# Altium schematic sheet AC-Cable.SchDoc: AC-Cable
size A4; Date: JUN 2020; ApprovedBy: Hören; CheckedBy: Mörz; Author: Rudziński; CompanyName: Semi-ATE; DrawnBy: Rudziński; Engineer: Hören; Organization: Semi-ATE; DocumentNumber: 12; Revision: V1.0; SheetNumber: 12; SheetTotal: 20
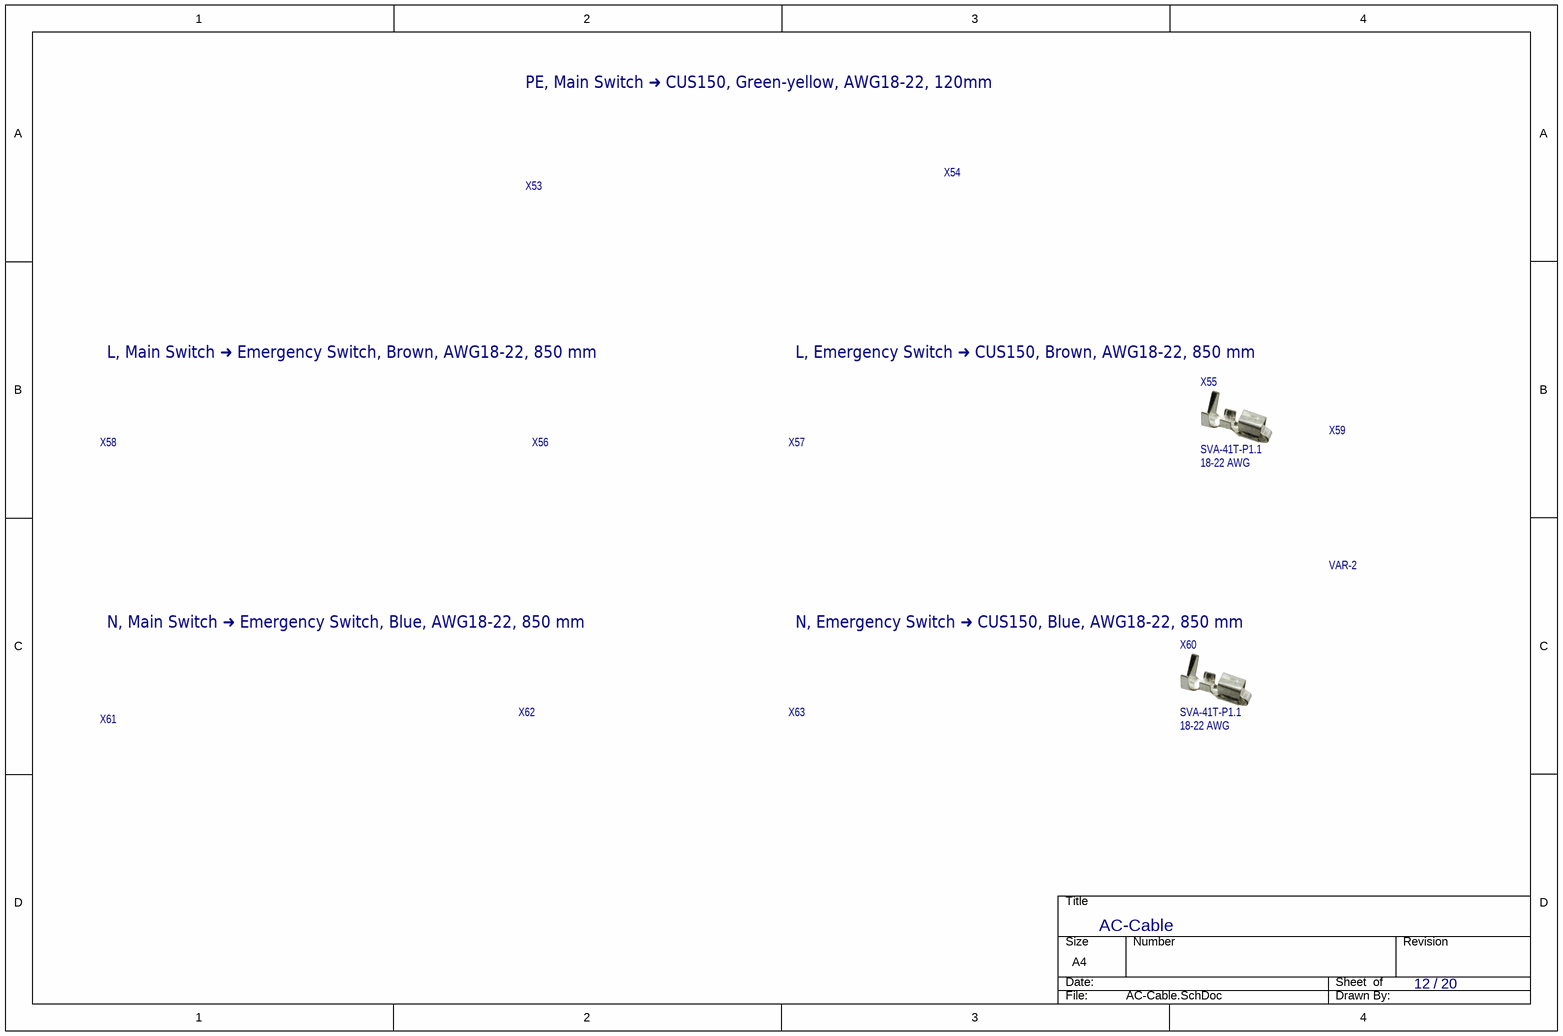
[diagram p0: AC-Cable.SchDoc]

## Parts
X53  X  (value not drawn)
X54  X  (value not drawn)
X55  Package: 18-22 AWG  (hidden comment: X)
X56  X  (value not drawn)
X57  X  (value not drawn)
X58  X  (value not drawn)
X59  X  (value not drawn)
X60  Package: 18-22 AWG  (hidden comment: X)
X61  X  (value not drawn)
X62  X  (value not drawn)
X63  X  (value not drawn)

## Notes on the sheet
- PE, Main Switch ➜ CUS150, Green-yellow, AWG18-22, 120mm
- L, Main Switch ➜ Emergency Switch, Brown, AWG18-22, 850 mm
- L, Emergency Switch ➜ CUS150, Brown, AWG18-22, 850 mm
- N, Main Switch ➜ Emergency Switch, Blue, AWG18-22, 850 mm
- N, Emergency Switch ➜ CUS150, Blue, AWG18-22, 850 mm
- /
- designed by
- reviewed by
- last drawn by
- Project:
- Schematic:
- last printed
- DIN-A4 L
- sheets
- of
- File:

## Library data of the parts
X53 X54 X56-X58 X61-X63 = 2-520407-2: CONN QC RCPT 18-22AWG 0.250; 04. Manufacturer: TE Connectivity AMP Connectors; 03. Unit Price: 0.36; 13. Created Date/Name: AUG 2018 / Hören; System: Connector; 01. Distributor: DigiKey; 02. Distributor Part Number: A27854-ND; 07. Manufacturer  Part Number: 2-520407-2; 11. RoHS: YES; ComponentLink1Description: Info; ComponentLink1URL: https://www.digikey.de/products/de?keywords=2-520407-2; ComponentLink2Description: DataSheet; ComponentLink2URL: https://www.te.com/commerce/DocumentDelivery/DDEController?Action=srchrtrv&DocNm=520407&DocType=Customer+Drawing&DocLang=English
X55 X60 = SVA-41T-P1.1: CONN SOCKET 18-20AWG CRIMP TIN; 04. Manufacturer: JST Sales America Inc.; 03. Unit Price: 0.1; 13. Created Date/Name: AUG 2018 / Hören; 01. Distributor: DigiKey; 02. Distributor Part Number: 455-2964-1-ND; 11. RoHS: YES; ComponentLink1Description: Info; ComponentLink1URL: https://www.digikey.de/product-detail/en/jst-sales-america-inc/SVH-21T-P1-1/455-1133-1-ND/527367; ComponentLink2Description: DataSheet; ComponentLink2URL: http://www.jst-mfg.com/product/pdf/eng/eVH.pdf; 07. Manufacturer  Part Number: SVA-41T-P1.1
X59 = VAR-2: CONN VA HOUSING 2POS; 04. Manufacturer: JST Sales America Inc.; 03. Unit Price: 0.15; 13. Created Date/Name: AUG 2018 / Hören; 01. Distributor: DigiKey; 02. Distributor Part Number: 455-2931-ND; 11. RoHS: YES; ComponentLink1Description: Info; ComponentLink1URL: https://www.digikey.de/product-detail/en/jst-sales-america-inc/SVH-21T-P1-1/455-1133-1-ND/527367; ComponentLink2Description: DataSheet; ComponentLink2URL: http://www.jst-mfg.com/product/pdf/eng/eVH.pdf; 07. Manufacturer  Part Number: VAR-2